# EAGLE design addonv2 (EAGLE 6.6.0)
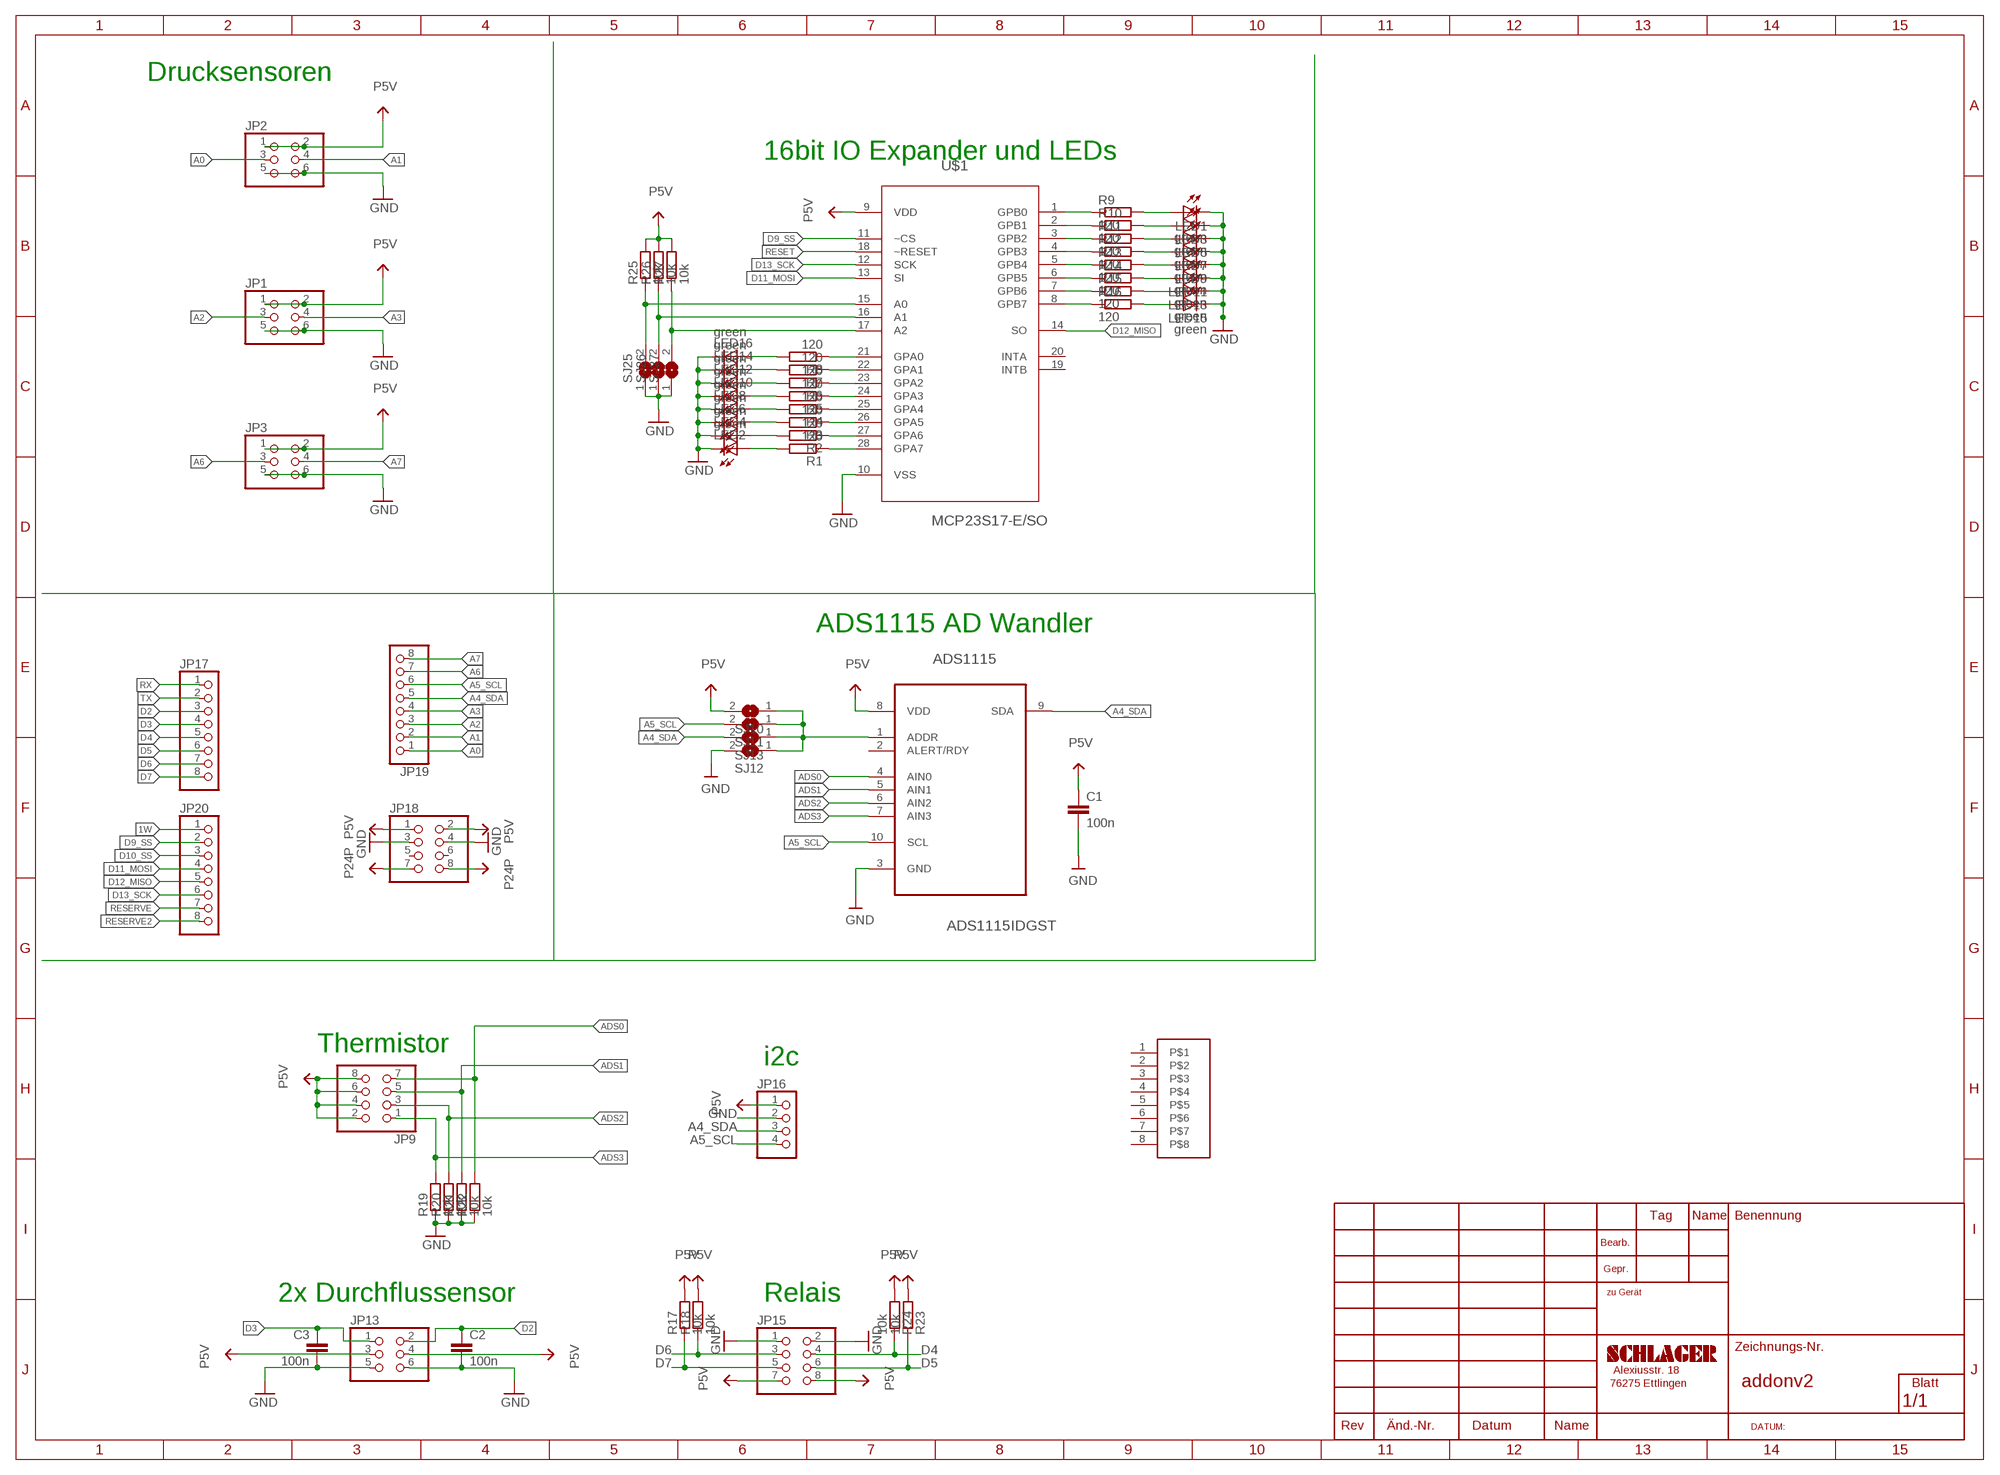
[diagram p0: schematic, sheet 1]

## Parts
ADS1115  ADS1115IDGST  [SOP50P490X110-10N]
C1  100n  C-EUC0805  [C0805]
C2  100n  C-EUC0805  [C0805]
C3  100n  C-EUC0805  [C0805]
JP1  PINHD-2X3/90  [2X03/90]
JP2  PINHD-2X3/90  [2X03/90]
JP3  PINHD-2X3/90  [2X03/90]
JP9  PINHD-2X4/90  [2X04/90]
JP13  PINHD-2X3/90  [2X03/90]
JP15  PINHD-2X4/90  [2X04/90]
JP16  PINHD-1X4/90  [1X04/90]
JP17  PINHD-1X8  [1X08]
JP18  PINHD-2X4  [2X04]
JP19  PINHD-1X8  [1X08]
JP20  PINHD-1X8  [1X08]
LED1  green  LEDCHIPLED_0805  [CHIPLED_0805]
LED2  green  LEDCHIPLED_0805  [CHIPLED_0805]
LED3  green  LEDCHIPLED_0805  [CHIPLED_0805]
LED4  green  LEDCHIPLED_0805  [CHIPLED_0805]
LED5  green  LEDCHIPLED_0805  [CHIPLED_0805]
LED6  green  LEDCHIPLED_0805  [CHIPLED_0805]
LED7  green  LEDCHIPLED_0805  [CHIPLED_0805]
LED8  green  LEDCHIPLED_0805  [CHIPLED_0805]
LED9  green  LEDCHIPLED_0805  [CHIPLED_0805]
LED10  green  LEDCHIPLED_0805  [CHIPLED_0805]
LED11  green  LEDCHIPLED_0805  [CHIPLED_0805]
LED12  green  LEDCHIPLED_0805  [CHIPLED_0805]
LED13  green  LEDCHIPLED_0805  [CHIPLED_0805]
LED14  green  LEDCHIPLED_0805  [CHIPLED_0805]
LED15  green  LEDCHIPLED_0805  [CHIPLED_0805]
LED16  green  LEDCHIPLED_0805  [CHIPLED_0805]
R1  120  R-EU_R0805  [R0805]
R2  120  R-EU_R0805  [R0805]
R3  120  R-EU_R0805  [R0805]
R4  120  R-EU_R0805  [R0805]
R5  120  R-EU_R0805  [R0805]
R6  120  R-EU_R0805  [R0805]
R7  120  R-EU_R0805  [R0805]
R8  120  R-EU_R0805  [R0805]
R9  120  R-EU_R0805  [R0805]
R10  120  R-EU_R0805  [R0805]
R11  120  R-EU_R0805  [R0805]
R12  120  R-EU_R0805  [R0805]
R13  120  R-EU_R0805  [R0805]
R14  120  R-EU_R0805  [R0805]
R15  120  R-EU_R0805  [R0805]
R16  120  R-EU_R0805  [R0805]
R17  10k  R-EU_R0805  [R0805]
R18  10k  R-EU_R0805  [R0805]
R19  10k  R-EU_R0805  [R0805]
R20  10k  R-EU_R0805  [R0805]
R21  10k  R-EU_R0805  [R0805]
R22  10k  R-EU_R0805  [R0805]
R23  10k  R-EU_R0805  [R0805]
R24  10k  R-EU_R0805  [R0805]
R25  10k  R-EU_R0805  [R0805]
R26  10k  R-EU_R0805  [R0805]
R27  10k  R-EU_R0805  [R0805]
SJ10  SJN  [SJ]
SJ11  SJN  [SJ]
SJ12  SJN  [SJ]
SJ13  SJN  [SJ]
SJ25  SJN  [SJ]
SJ26  SJN  [SJ]
SJ27  SJN  [SJ]
U$1  MCP23S17-E/SO  [SOIC127P030X265-28N]
U$2  1.44-128X128  [1.44-128X128]

## Nets
1W: JP20.1
A0: JP2.3 JP19.1
A1: JP2.4 JP19.2
A2: JP1.3 JP19.3
A3: JP1.4 JP19.4
A4_SDA: ADS1115.9(SDA) JP16.3 JP19.5 SJ13.2
A5_SCL: ADS1115.10(SCL) JP16.4 JP19.6 SJ11.2
A6: JP3.3 JP19.7
A7: JP3.4 JP19.8
ADS0: ADS1115.4(AIN0) JP9.7 R22.2
ADS1: ADS1115.5(AIN1) JP9.5 R21.2
ADS2: ADS1115.6(AIN2) JP9.3 R20.2
ADS3: ADS1115.7(AIN3) JP9.1 R19.2
D2: C2.1 JP13.2 JP17.3
D3: C3.1 JP13.1 JP17.4
D4: JP15.4 JP17.5 R24.1
D5: JP15.6 JP17.6 R23.1
D6: JP15.3 JP17.7 R18.1
D7: JP15.5 JP17.8 R17.1
D9_SS: JP20.2 U$1.11(~CS)
D10_SS: JP20.3
D11_MOSI: JP20.4 U$1.13(SI)
D12_MISO: JP20.5 U$1.14(SO)
D13_SCK: JP20.6 U$1.12(SCK)
GND: ADS1115.3(GND) C1.2 C2.2 C3.2 JP1.5 JP1.6 JP2.5 JP2.6 JP3.5 JP3.6 JP13.5 JP13.6 JP15.1 JP15.2 JP16.2 JP18.3 JP18.4 LED1.C LED2.C LED3.C LED4.C LED5.C LED6.C LED7.C LED8.C LED9.C LED10.C LED11.C LED12.C LED13.C LED14.C LED15.C LED16.C R19.1 R20.1 R21.1 R22.1 SJ12.2 SJ25.1 SJ26.1 SJ27.1 U$1.10(VSS)
N$1: LED1.A R9.2
N$2: LED3.A R10.2
N$3: LED5.A R11.2
N$4: LED7.A R12.2
N$5: LED9.A R13.2
N$6: LED11.A R14.2
N$7: LED13.A R15.2
N$8: LED15.A R16.2
N$9: R9.1 U$1.1(GPB0)
N$10: R10.1 U$1.2(GPB1)
N$11: R11.1 U$1.3(GPB2)
N$12: R12.1 U$1.4(GPB3)
N$13: R13.1 U$1.5(GPB4)
N$14: R14.1 U$1.6(GPB5)
N$15: R15.1 U$1.7(GPB6)
N$16: R16.1 U$1.8(GPB7)
N$17: LED2.A R1.2
N$18: LED4.A R2.2
N$19: LED6.A R3.2
N$20: LED8.A R4.2
N$21: LED10.A R5.2
N$22: LED12.A R6.2
N$23: LED14.A R7.2
N$24: LED16.A R8.2
N$25: R1.1 U$1.28(GPA7)
N$26: R2.1 U$1.27(GPA6)
N$27: R3.1 U$1.26(GPA5)
N$28: R4.1 U$1.25(GPA4)
N$29: R5.1 U$1.24(GPA3)
N$30: R6.1 U$1.23(GPA2)
N$31: R7.1 U$1.22(GPA1)
N$32: R8.1 U$1.21(GPA0)
N$36: ADS1115.1(ADDR) SJ10.1 SJ11.1 SJ12.1 SJ13.1
N$38: R25.1 SJ25.2 U$1.15(A0)
N$39: R26.1 SJ26.2 U$1.16(A1)
N$40: R27.1 SJ27.2 U$1.17(A2)
P5V: ADS1115.8(VDD) C1.1 JP1.1 JP1.2 JP2.1 JP2.2 JP3.1 JP3.2 JP9.2 JP9.4 JP9.6 JP9.8 JP13.3 JP13.4 JP15.7 JP15.8 JP16.1 JP18.1 JP18.2 R17.2 R18.2 R23.2 R24.2 R25.2 R26.2 R27.2 SJ10.2 U$1.9(VDD)
P24P: JP18.7 JP18.8
RESERVE: JP20.7
RESERVE2: JP20.8
RESET: U$1.18(~RESET)
RX: JP17.1
TX: JP17.2
Unconnected: ADS1115.2(ALERT/RDY) JP18.5 JP18.6 U$1.19(INTB) U$1.20(INTA) U$2.1 U$2.2 U$2.3 U$2.4 U$2.5 U$2.6 U$2.7 U$2.8

## Notes on the sheet
- Drucksensoren
- 16bit IO Expander und LEDs
- ADS1115 AD Wandler
- Thermistor
- i2c
- 2x Durchflussensor | Relais

## Library data of the parts
ADS1115 = schlager_ics:ADS1115IDGST: Analog-to-Digital Converter with Internal Reference; MPN: ADS1115IDGST; OC_FARNELL: 1762981; OC_NEWARK: 25R1241; PACKAGE: MSOP-10; SUPPLIER: Texas Instruments
C1-C3 = schlager_passiv:C-EU: CAPACITOR, European symbol
JP1-JP3 JP13 = pinhead:PINHD-2X3: PIN HEADER
JP9 JP15 JP18 = pinhead:PINHD-2X4: PIN HEADER
JP16 = pinhead:PINHD-1X4: PIN HEADER
JP17 JP19 JP20 = pinhead:PINHD-1X8: PIN HEADER
LED1-LED16 = led:LED: LED OSRAM: - CHIPLED LG R971, LG N971, LY N971, LG Q971, LY Q971, LO R971, LY R971 LH N974, LH R974 LS Q976, LO Q976, LY Q976 LO Q996 - Hyper CHIPLED LW Q18S LB Q993, LB Q99A, LB R99A - SideLED LS A670, LO A670, LY A670, LG A670, LP A670 LB A673, LV A673, LT A673, LW A673 LH A674 LY A675 LS A676, LA A676, LO A676, LY A676, LW A676 LS A679, LY A679, LG A679 - Hyper Micro SIDELED® LS Y876, LA Y876, LO Y876, LY Y876 LT Y87S - SmartLED LW L88C, LW L88S LB L89C, LB L89S, LG L890 LS L89K, LO L89K, LY L89K LS L896, LA L896, LO L896, LY L896 - TOPLED LS T670, LO T670, LY T670, LG T670, LP T670 LSG T670, LSP T670, LSY T670, LOP T670, LYG T670 LG T671, LOG T671, LSG T671 LB T673, LV T673, LT T673, LW T673 LH T674 LS T676, LA T676, LO T676, LY T676, LB T676, LH T676, LSB T676, LW T676 LB T67C, LV T67C, LT T67C, LS T67K, LO T67K, LY T67K, LW E67C LS E67B, LA E67B, LO E67B, LY E67B, LB E67C, LV E67C, LT E67C LW T67C LS T679, LY T679, LG T679 LS T770, LO T770, LY T770, LG T770, LP T770 LB T773, LV T773, LT T773, LW T773 LH T774 LS E675, LA E675, LY E675, LS T675 LS T776, LA T776, LO T776, LY T776, LB T776 LHGB T686 LT T68C, LB T68C - Hyper Mini TOPLED® LB M676 - Mini TOPLED Santana® LG M470 LS M47K, LO M47K, LY M47K Source: http://www.osram.convergy.de LUXEON: - LUMILED® LXK2-PW12-R00, LXK2-PW12-S00, LXK2-PW14-U00, LXK2-PW14-V00 LXK2-PM12-R00, LXK2-PM12-S00, LXK2-PM14-U00 LXK2-PE12-Q00, LXK2-PE12-R00, LXK2-PE12-S00, LXK2-PE14-T00, LXK2-PE14-U00 LXK2-PB12-K00, LXK2-PB12-L00, LXK2-PB12-M00, LXK2-PB14-N00, LXK2-PB14-P00, LXK2-PB14-Q00 LXK2-PR12-L00, LXK2-PR12-M00, LXK2-PR14-Q00, LXK2-PR14-R00 LXK2-PD12-Q00, LXK2-PD12-R00, LXK2-PD12-S00 LXK2-PH12-R00, LXK2-PH12-S00 LXK2-PL12-P00, LXK2-PL12-Q00, LXK2-PL12-R00 Source: www.luxeon.com KINGBRIGHT: KA-3528ASYC Source: www.kingbright.com
R1-R27 = rcl:R-EU_: RESISTOR, European symbol
SJ10-SJ13 SJ25-SJ27 = jumper:SJ: SMD solder JUMPER
U$1 = schlager_ics:MCP23S17-E/SO: 16-Bit I/O Expander; DESCRIPTION: IC I/O EXPANDER; MPN: MCP23S17-E/SO; OC_FARNELL: 1332093; OC_NEWARK: 31K2950; PACKAGE: SOIC-28; SUPPLIER: Microchip
U$2 = schlager_modules:1.44-128X128

## Net classes
4 USBpair: width 0.254 mm, drill 0.406 mm, clearance 0.508 mm

## Board
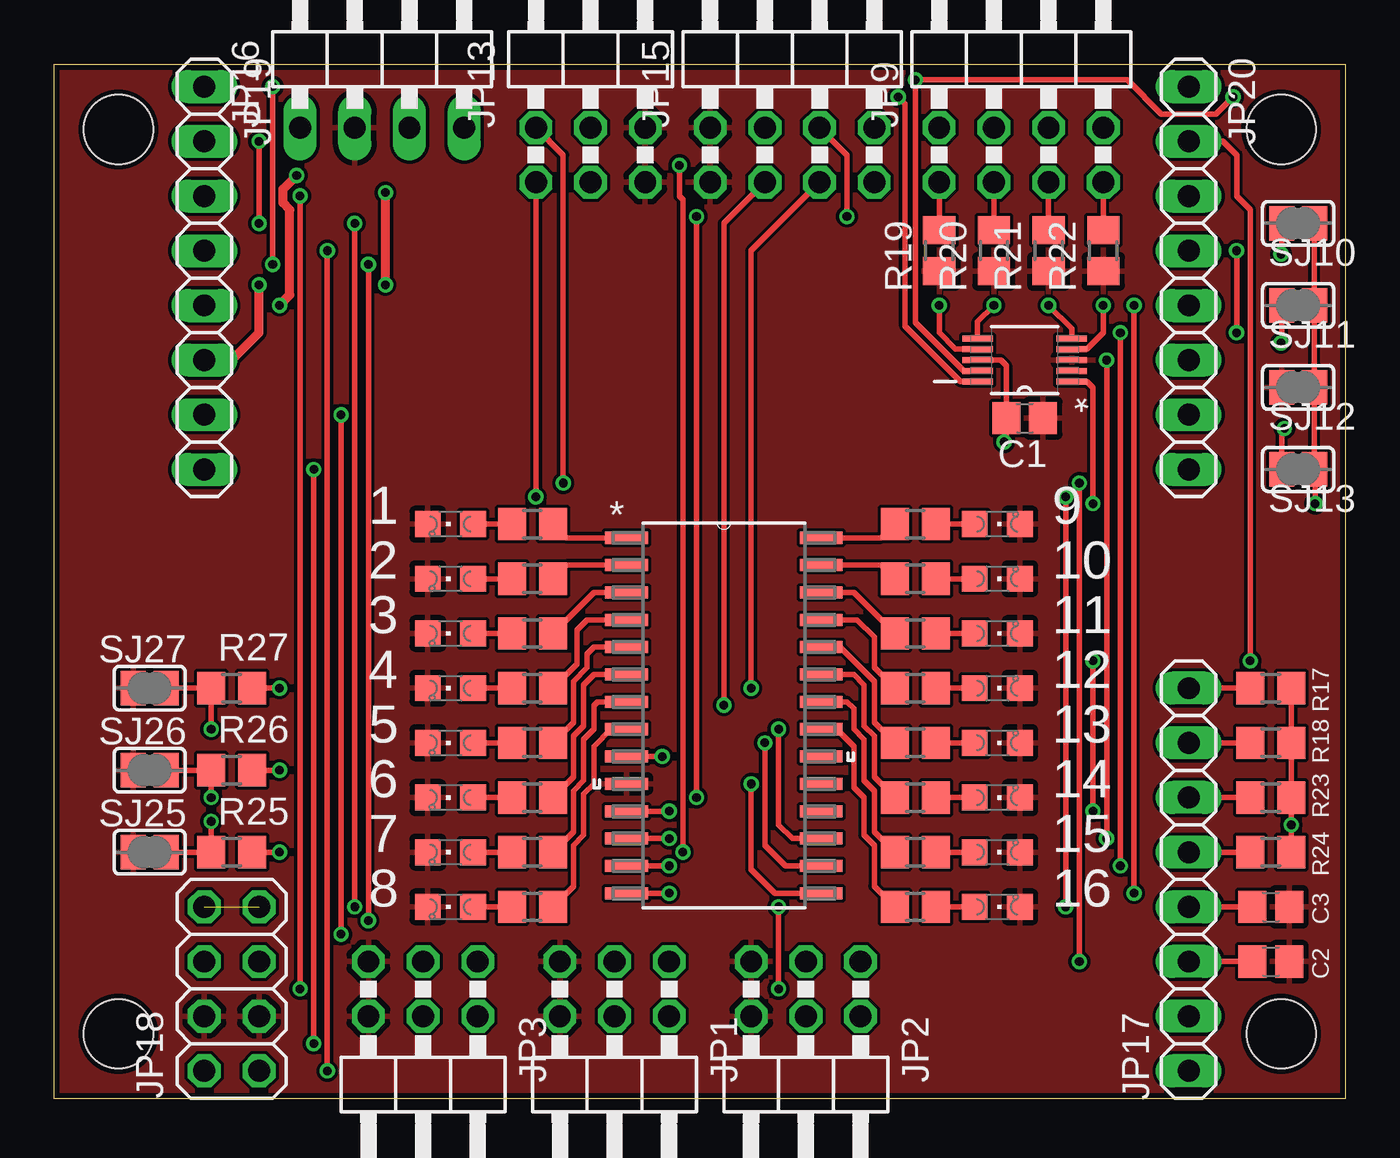
[diagram p1: board, top side]
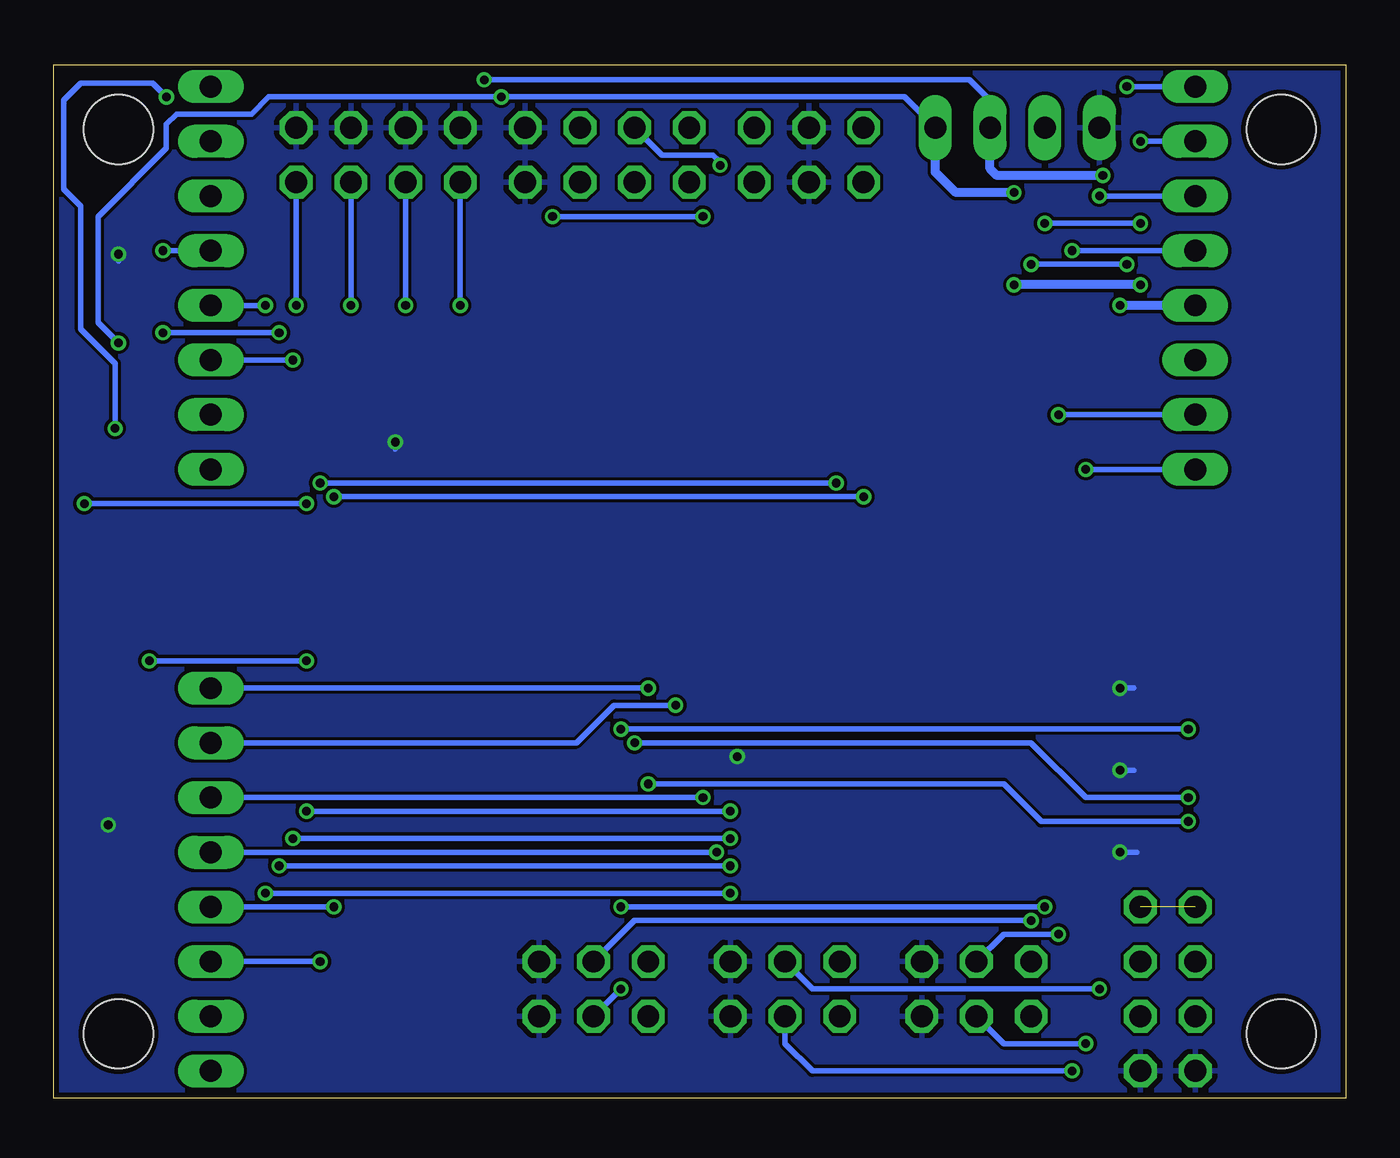
[diagram p2: board, bottom side, seen from below]

Size 60 x 48 mm. Coordinates in mm from the lower left corner, seen from the top.
Outline: 0,0 60,0 60,48 0,48 0,0
Copper layers (1*16): Top 0.035mm / dielectric 1.5mm / Bottom 0.035mm
Design rules "ITEADstudio_DRC": minimum track width 6mil, minimum drill 12mil, track to track 6mil, track to pad 6mil, pad to pad 6mil, via to via 6mil, smd to smd 0mil, copper to edge 10mil, drill to drill 10mil, minimum pad ring 10mil, minimum via ring 6mil, stop-mask expansion 2mil, vias tented up to drill 100mil, thermal gap 10mil
Holes 3.2 mm at 57,45 57,3 3,45 3,3

### Footprints (pad centres in the part's own frame; a part is rotated, then mirrored left to right if it is on the bottom)
SOP50P490X110-10N = smd 1.422 x 0.279: 1 -2.184,0.991; 2 -2.184,0.508; 3 -2.184,0; 4 -2.184,-0.508; 5 -2.184,-0.991; 6 2.184,-0.991; 7 2.184,-0.508; 8 2.184,0; 9 2.184,0.508; 10 2.184,0.991
C0805 = smd 1.3 x 1.5: 1 -0.85,0; 2 0.85,0
2X03/90 = drill 1.016 octagon: 1 -2.54,-6.35; 2 -2.54,-3.81; 3 0,-6.35; 4 0,-3.81; 5 2.54,-6.35; 6 2.54,-3.81
2X04/90 = drill 1.016 octagon: 1 -3.81,-6.35; 2 -3.81,-3.81; 3 -1.27,-6.35; 4 -1.27,-3.81; 5 1.27,-6.35; 6 1.27,-3.81; 7 3.81,-6.35; 8 3.81,-3.81
1X04/90 = drill 1.016 long: 1 -3.81,-3.81; 2 -1.27,-3.81; 3 1.27,-3.81; 4 3.81,-3.81
1X08 = drill 1.016 long: 1 -8.89,0; 2 -6.35,0; 3 -3.81,0; 4 -1.27,0; 5 1.27,0; 6 3.81,0; 7 6.35,0; 8 8.89,0
2X04 = drill 1.016 octagon: 1 -3.81,-1.27; 2 -3.81,1.27; 3 -1.27,-1.27; 4 -1.27,1.27; 5 1.27,-1.27; 6 1.27,1.27; 7 3.81,-1.27; 8 3.81,1.27
CHIPLED_0805 = smd 1.2 x 1.2: A 0,-1.05; C 0,1.05
R0805 = smd 1.3 x 1.5: 1 -0.95,0; 2 0.95,0
SJ = smd 1.168 x 1.6: 1 -0.762,0; 2 0.762,0
SOIC127P030X265-28N = smd 1.981 x 0.559: 1 -4.521,8.255; 2 -4.521,6.985; 3 -4.521,5.715; 4 -4.521,4.445; 5 -4.521,3.175; 6 -4.521,1.905; 7 -4.521,0.635; 8 -4.521,-0.635; 9 -4.521,-1.905; 10 -4.521,-3.175; 11 -4.521,-4.445; 12 -4.521,-5.715; 13 -4.521,-6.985; 14 -4.521,-8.255; 15 4.521,-8.255; 16 4.521,-6.985; 17 4.521,-5.715; 18 4.521,-4.445; 19 4.521,-3.175; 20 4.521,-1.905; 21 4.521,-0.635; 22 4.521,0.635; 23 4.521,1.905; 24 4.521,3.175; 25 4.521,4.445; 26 4.521,5.715; 27 4.521,6.985; 28 4.521,8.255
1.44-128X128 = drill 1.016 long: 1 7.27,2.14; 2 9.81,2.14; 3 12.35,2.14; 4 14.89,2.14; 5 17.43,2.14; 6 19.97,2.14; 7 22.51,2.14; 8 25.05,2.14

### Placement (x,y rotation side)
ADS1115  45.09,34.29 180 top
C1  45.09,31.59 0 top
C2  56.52,6.35 0 top
C3  56.52,8.89 0 top
JP1  26.04,0 180 top
JP2  34.93,0 180 top
JP3  17.15,0 180 top
JP9  44.93,48.9 0 top
JP13  24.93,48.9 0 top
JP15  34.3,48.9 0 top
JP16  15.24,48.9 0 top
JP17  52.71,10.16 90 top
JP18  8.26,5.08 90 top
JP19  6.99,38.1 270 top
JP20  52.71,38.1 270 top
LED1  18.42,26.67 90 top
LED2  43.82,26.67 270 top
LED3  18.42,24.13 90 top
LED4  43.82,24.13 270 top
LED5  18.42,21.59 90 top
LED6  43.82,21.59 270 top
LED7  18.42,19.05 90 top
LED8  43.82,19.05 270 top
LED9  18.42,16.51 90 top
LED10  43.82,16.51 270 top
LED11  18.42,13.97 90 top
LED12  43.82,13.97 270 top
LED13  18.42,11.43 90 top
LED14  43.82,11.43 270 top
LED15  18.42,8.89 90 top
LED16  43.82,8.89 270 top
R1  40.01,26.67 0 top
R2  40.01,24.13 0 top
R3  40.01,21.59 0 top
R4  40.01,19.05 0 top
R5  40.01,16.51 0 top
R6  40.01,13.97 0 top
R7  40.01,11.43 0 top
R8  40.01,8.89 0 top
R9  22.23,26.67 180 top
R10  22.23,24.13 180 top
R11  22.23,21.59 180 top
R12  22.23,19.05 180 top
R13  22.23,16.51 180 top
R14  22.23,13.97 180 top
R15  22.23,11.43 180 top
R16  22.23,8.89 180 top
R17  56.52,19.05 0 top
R18  56.52,16.51 0 top
R19  41.12,39.37 90 top
R20  43.66,39.37 90 top
R21  46.2,39.37 90 top
R22  48.74,39.37 90 top
R23  56.52,13.97 0 top
R24  56.52,11.43 0 top
R25  8.26,11.43 0 top
R26  8.26,15.24 0 top
R27  8.26,19.05 0 top
SJ10  57.79,40.64 180 top
SJ11  57.79,36.83 180 top
SJ12  57.79,33.02 180 top
SJ13  57.79,29.21 180 top
SJ25  4.45,11.43 0 top
SJ26  4.45,15.24 0 top
SJ27  4.45,19.05 0 top
U$1  31.12,17.78 0 top
U$2  76.84,30.48 0 top  (outside the outline)

### Tracks (layer width: path | path; a pad name or v marks a point on that pad's centre or on a via)
A0  (via drill 0.4)
  Top 0.254: v14.61,8.26 v14.61,38.73 | v10.16,38.73 v10.16,46.99
  Bottom 0.254: JP2.3 33.03,8.26 v14.61,8.26 | v14.61,38.73 v10.16,38.73 | v10.16,46.99 JP19.1
A1  (via drill 0.4)
  Top 0.254: v9.53,44.45 v9.53,40.64 | v13.98,40.64 v13.98,8.89 | v33.66,8.89 v33.66,5.08
  Bottom 0.254: JP19.2 v9.53,44.45 | v9.53,40.64 v13.98,40.64 | v13.98,8.89 v33.66,8.89 | v33.66,5.08 JP2.4
A2  (via drill 0.4)
  Top 0.254: v11.44,5.08 v11.44,41.91
  Bottom 0.254: JP1.3 24.77,5.08 v11.44,5.08 | v11.44,41.91 JP19.3
A3  (via drill 0.4)
  Top 0.254: v12.7,39.37 v12.7,1.27
  Bottom 0.254: JP19.4 v12.7,39.37 | v12.7,1.27 24.77,1.27 26.04,2.54 JP1.4
A4_SDA  (via drill 0.4)
  Top 0.254: ADS1115.9 42.26,33.78 40.01,36.04 v40.01,47.31 49.85,47.31 51.44,45.72 53.98,45.72 v54.77,46.51 | SJ13.2 57.03,30.99 v57.16,31.11
  Top 0.406: v10.48,36.83 10.96,37.31 10.96,41.27 10.64,41.59 10.64,42.23 v11.28,42.86
  Bottom 0.254: v40.01,47.31 17.47,47.31 16.52,46.35 JP16.3 | JP16.3 16.52,44.77 16.67,44.61 16.52,44.45 JP16.3 | v57.16,31.11 57.16,34.13 58.74,35.72 58.74,41.43 59.54,42.23 59.54,46.35 58.74,47.15 55.41,47.15 v54.77,46.51
  Bottom 0.406: JP19.5 v10.48,36.83 | v11.28,42.86 16.2,42.86 16.52,43.18 16.52,44.45
A5_SCL  (via drill 0.4)
  Top 0.254: ADS1115.10 42.11,33.3 39.53,35.88 39.53,46.2 v39.22,46.51 | SJ11.2 57.03,35.12 v57,35.08
  Top 0.406: JP19.6 8.26,34.29 9.53,35.56 v9.53,37.78 | v15.4,37.78 v15.4,42.07
  Bottom 0.254: JP16.4 20.48,46.51 v39.22,46.51 50.01,46.51 50.81,45.72 54.3,45.72 54.77,45.24 54.77,44.13 57.95,40.96 57.95,36.04 v57,35.08
  Bottom 0.406: v9.53,37.78 v15.4,37.78 | v15.4,42.07 18.1,42.07 19.05,43.02 JP16.4
A6  (via drill 0.4)
  Top 0.254: v13.34,31.75 v13.34,7.62
  Bottom 0.254: JP19.7 v13.34,31.75 | v13.34,7.62 15.88,7.62 JP3.3
A7  (via drill 0.4)
  Top 0.254: v12.07,2.54 v12.07,29.21
  Bottom 0.254: JP3.4 15.88,2.54 v12.07,2.54 | v12.07,29.21 JP19.8
ADS0  (via drill 0.4)
  Top 0.254: ADS1115.4 47.98,34.8 48.74,35.56 v48.74,36.83 | R22.2 JP9.7
  Bottom 0.254: v48.74,36.83 JP9.7
ADS1  (via drill 0.4)
  Top 0.254: ADS1115.5 47.27,35.76 v46.2,36.83 | R21.2 JP9.5
  Bottom 0.254: v46.2,36.83 JP9.5
ADS2  (via drill 0.4)
  Top 0.254: ADS1115.6 42.91,36.07 v43.66,36.83 | R20.2 JP9.3
  Bottom 0.254: v43.66,36.83 JP9.3
ADS3  (via drill 0.4)
  Top 0.254: ADS1115.7 41.88,34.8 41.12,35.56 v41.12,36.83 | R19.2 JP9.1
  Bottom 0.254: v41.12,36.83 JP9.1
D2  (via drill 0.4)
  Top 0.254: C2.1 JP17.3 | v47.63,6.35 v47.63,28.57 | v23.66,28.57 23.66,43.81 JP13.2
  Bottom 0.254: JP17.3 v47.63,6.35 | v47.63,28.57 v23.66,28.57
D3  (via drill 0.4)
  Top 0.254: C3.1 JP17.4 | JP13.1 v22.39,27.94 | v47,27.94 v47,8.89
  Bottom 0.254: v22.39,27.94 v47,27.94 | v47,8.89 JP17.4
D4  (via drill 0.4)
  Top 0.254: R24.1 JP17.5 | v29.22,11.43 29.22,41.75 29.06,41.91 v29.06,43.34
  Bottom 0.254: JP17.5 v29.22,11.43 | v29.06,43.34 29.06,43.5 29.37,43.81 31.75,43.81 JP15.4
D5  (via drill 0.4)
  Top 0.254: R23.1 JP17.6 | v29.85,13.97 v29.85,40.96 | v36.83,40.96 36.83,43.81 JP15.6
  Bottom 0.254: JP17.6 v29.85,13.97 | v29.85,40.96 v36.83,40.96
D6  (via drill 0.4)
  Top 0.254: R18.1 JP17.7 | v31.12,18.26 31.12,40.64 JP15.3
  Bottom 0.254: JP17.7 35.72,16.51 33.98,18.26 v31.12,18.26
D7  (via drill 0.4)
  Top 0.254: R17.1 JP17.8 | v32.39,19.05 32.39,39.37 JP15.5
  Bottom 0.254: v32.39,19.05 JP17.8
D9_SS  (via drill 0.4)
  Top 0.254: U$1.11 v28.58,13.34 | v48.27,13.34 v48.27,20.32 | JP20.2 54.3,44.45 54.93,43.81 54.93,41.91 55.57,41.27 v55.57,20.32
  Bottom 0.254: v28.58,13.34 v48.27,13.34 | v48.27,20.32 v55.57,20.32
D11_MOSI  (via drill 0.4)
  Top 0.254: U$1.13 v28.58,10.79 | v49.53,10.79 v49.53,35.56 | v54.93,35.56 v54.93,39.37
  Bottom 0.254: v28.58,10.79 v49.53,10.79 | v49.53,35.56 v54.93,35.56 | v54.93,39.37 JP20.4
D12_MISO  (via drill 0.4)
  Top 0.254: U$1.14 v28.58,9.53 | v50.17,9.53 v50.17,36.83
  Bottom 0.254: v28.58,9.53 v50.17,9.53 | v50.17,36.83 JP20.5
D13_SCK  (via drill 0.4)
  Top 0.254: U$1.12 v28.58,12.06 | v48.9,12.06 v48.9,34.29
  Bottom 0.254: v28.58,12.06 v48.9,12.06 | v48.9,34.29 JP20.6
GND
  pour Top (rank 5): -86.2,68.58 67.95,68.58 67.95,-30.48 -86.51,-30.32
N$1
  Top 0.254: R9.2 LED1.A
N$2
  Top 0.254: LED3.A R10.2
N$3
  Top 0.254: R11.2 LED5.A
N$4
  Top 0.254: LED7.A R12.2
N$5
  Top 0.254: R13.2 LED9.A
N$6
  Top 0.254: LED11.A R14.2
N$7
  Top 0.254: R15.2 LED13.A
N$8
  Top 0.254: R16.2 LED15.A
N$9
  Top 0.254: U$1.1 23.81,26.04 R9.1
N$10
  Top 0.254: U$1.2 23.81,24.77 R10.1
N$11
  Top 0.254: U$1.3 25.08,23.5 R11.1
N$12
  Top 0.254: U$1.4 24.77,22.23 24.29,21.75 24.29,20.16 R12.1
N$13
  Top 0.254: U$1.5 25.09,20.95 24.77,20.64 24.77,20 24.14,19.37 24.14,17.46 R13.1
N$14
  Top 0.254: U$1.6 25.09,19.68 24.61,19.21 24.61,17.3 24.14,16.83 24.14,14.93 R14.1
N$15
  Top 0.254: U$1.7 25.25,18.41 25.09,18.26 25.09,17.14 24.61,16.67 24.61,14.76 24.14,14.29 24.14,12.38 R15.1
N$16
  Top 0.254: U$1.8 25.88,17.14 25.09,16.35 25.09,14.61 24.61,14.13 24.61,12.22 24.14,11.75 24.14,9.85 R16.1
N$17
  Top 0.254: R1.2 LED2.A
N$18
  Top 0.254: LED4.A R2.2
N$19
  Top 0.254: R3.2 LED6.A
N$20
  Top 0.254: LED8.A R4.2
N$21
  Top 0.254: R5.2 LED10.A
N$22
  Top 0.254: LED12.A R6.2
N$23
  Top 0.254: R7.2 LED14.A
N$24
  Top 0.254: LED16.A R8.2
N$25
  Top 0.254: U$1.28 38.42,26.04 R1.1
N$26
  Top 0.254: U$1.27 38.42,24.77 R2.1
N$27
  Top 0.254: U$1.26 37.16,23.5 R3.1
N$28
  Top 0.254: U$1.25 37.31,22.23 38.11,21.43 38.11,20 R4.1
N$29
  Top 0.254: U$1.24 36.52,20.95 38.11,19.37 38.11,17.46 R5.1
N$30
  Top 0.254: U$1.23 37.15,19.68 37.63,19.21 37.63,17.3 38.11,16.83 38.11,14.93 R6.1
N$31
  Top 0.254: U$1.22 36.83,18.41 37.15,18.1 37.15,17.14 37.63,16.67 37.63,14.76 38.11,14.29 38.11,12.38 R7.1
N$32
  Top 0.254: U$1.21 36.36,17.14 37.15,16.35 37.15,14.45 37.63,13.97 37.63,12.22 38.11,11.75 38.11,9.85 R8.1
N$36  (via drill 0.4)
  Top 0.254: SJ10.1 SJ11.1 SJ12.1 SJ13.1 58.58,29.18 v58.58,27.62 | ADS1115.1 47.99,33.3 48.27,33.02 v48.27,27.62
  Bottom 0.254: v48.27,27.62 v58.58,27.62
N$38  (via drill 0.4)
  Top 0.254: SJ25.2 R25.1 v7.31,12.86 | v32.39,14.61 32.39,10.64 33.5,9.53 U$1.15
  Bottom 0.254: v7.31,12.86 14.13,12.86 15.88,14.61 v32.39,14.61
N$39  (via drill 0.4)
  Top 0.254: SJ26.2 R26.1 v7.31,13.97 | U$1.16 33.98,10.79 33.03,11.75 v33.03,16.51
  Bottom 0.254: v33.03,16.51 14.61,16.51 12.07,13.97 v7.31,13.97
N$40  (via drill 0.4)
  Top 0.254: SJ27.2 R27.1 v7.31,17.15 v7.31,17.14 | v33.66,17.14 33.66,12.7 34.3,12.06 U$1.17
  Bottom 0.254: v7.31,17.14 v33.66,17.14
P5V  (via drill 0.4)
  Top 0.254: U$1.9 v28.26,15.88 | R17.2 R18.2 R23.2 R24.2 v57.47,12.7 | ADS1115.8 43.98,34.29 44.24,34.03 C1.1 44.24,30.58 v44.14,30.48 | R26.2 v10.48,15.24 | R25.2 v10.48,11.43 | R27.2 v10.48,19.05 | SJ10.2 57.03,39.24 v57,39.21
  Bottom 0.254: v44.14,30.48 44.14,30.16 | v10.48,15.24 9.85,15.24 | v10.48,11.43 9.69,11.43 | v10.48,19.05 9.85,19.05 | v57,39.21 57,38.89
  pour Bottom: -89.53,71.12 79.38,71.12 79.38,-38.1 -88.26,-39.37
P24P  (1 unrouted)

### Text on the board
tPlace: 1 | 9 | 2 | 10 | 3 | 11 | 4 | 12 | 5 | 13 | 6 | 14 | 7 | 15 | 8 | 16